# EasyEDA Pro project connect.eprj

# Schematic Schematic1
Create Date: 2023-11-16; Page Name: P1; Project Name: connect; Schematic Name: Schematic1; Update Date: 2023-11-19; Company: 嘉立创EDA; Page Size: A4; Version: V1.0
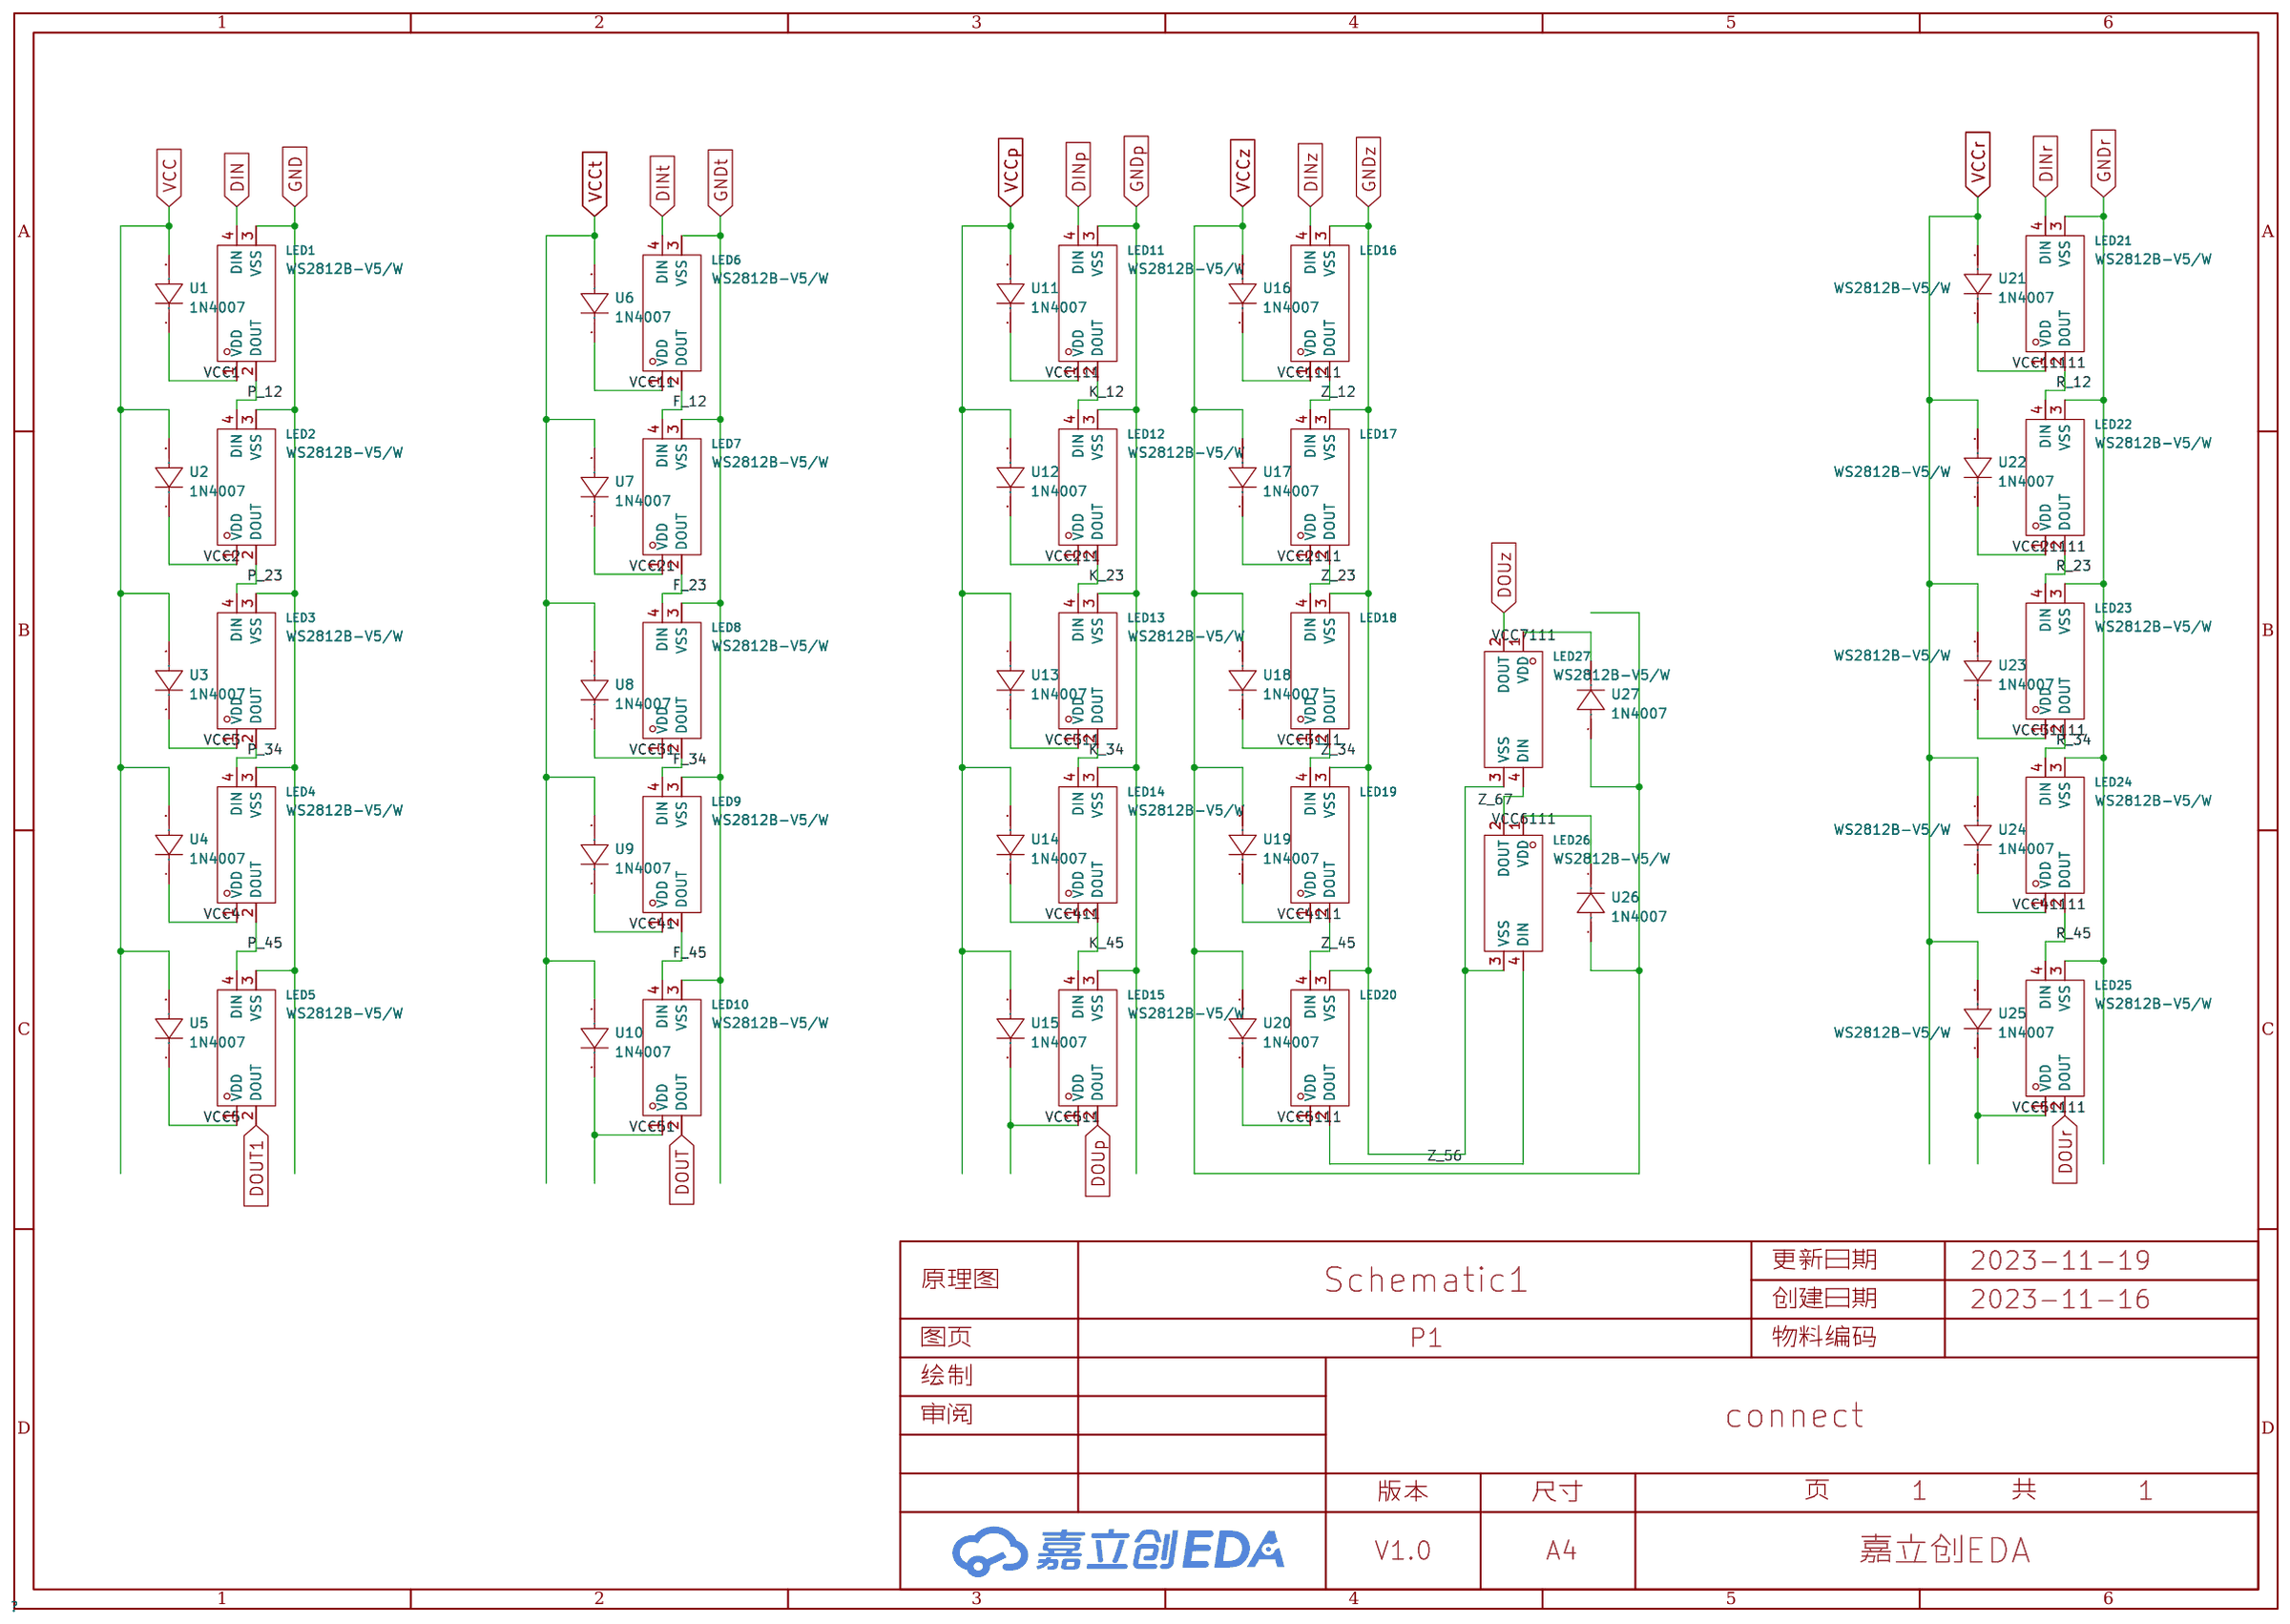
[diagram p0: schematic sheet]

## Parts
LED1  WS2812B-V5/W  [LED-SMD_4P-L5.0-W5.0-TL-1]
LED2  WS2812B-V5/W  [LED-SMD_4P-L5.0-W5.0-TL-1]
LED3  WS2812B-V5/W  [LED-SMD_4P-L5.0-W5.0-TL-1]
LED4  WS2812B-V5/W  [LED-SMD_4P-L5.0-W5.0-TL-1]
LED5  WS2812B-V5/W  [LED-SMD_4P-L5.0-W5.0-TL-1]
LED6  WS2812B-V5/W  [LED-SMD_4P-L5.0-W5.0-TL-1]
LED7  WS2812B-V5/W  [LED-SMD_4P-L5.0-W5.0-TL-1]
LED8  WS2812B-V5/W  [LED-SMD_4P-L5.0-W5.0-TL-1]
LED9  WS2812B-V5/W  [LED-SMD_4P-L5.0-W5.0-TL-1]
LED10  WS2812B-V5/W  [LED-SMD_4P-L5.0-W5.0-TL-1]
LED11  WS2812B-V5/W  [LED-SMD_4P-L5.0-W5.0-TL-1]
LED12  WS2812B-V5/W  [LED-SMD_4P-L5.0-W5.0-TL-1]
LED13  WS2812B-V5/W  [LED-SMD_4P-L5.0-W5.0-TL-1]
LED14  WS2812B-V5/W  [LED-SMD_4P-L5.0-W5.0-TL-1]
LED15  WS2812B-V5/W  [LED-SMD_4P-L5.0-W5.0-TL-1]
LED16  WS2812B-V5/W  [LED-SMD_4P-L5.0-W5.0-TL-1]
LED17  WS2812B-V5/W  [LED-SMD_4P-L5.0-W5.0-TL-1]
LED18  WS2812B-V5/W  [LED-SMD_4P-L5.0-W5.0-TL-1]
LED19  WS2812B-V5/W  [LED-SMD_4P-L5.0-W5.0-TL-1]
LED20  WS2812B-V5/W  [LED-SMD_4P-L5.0-W5.0-TL-1]
LED21  WS2812B-V5/W  [LED-SMD_4P-L5.0-W5.0-TL-1]
LED22  WS2812B-V5/W  [LED-SMD_4P-L5.0-W5.0-TL-1]
LED23  WS2812B-V5/W  [LED-SMD_4P-L5.0-W5.0-TL-1]
LED24  WS2812B-V5/W  [LED-SMD_4P-L5.0-W5.0-TL-1]
LED25  WS2812B-V5/W  [LED-SMD_4P-L5.0-W5.0-TL-1]
LED26  WS2812B-V5/W  [LED-SMD_4P-L5.0-W5.0-TL-1]
LED27  WS2812B-V5/W  [LED-SMD_4P-L5.0-W5.0-TL-1]
U1  1N4007  [SMA_L4.3-W2.6-LS5.1-RD]
U2  1N4007  [SMA_L4.3-W2.6-LS5.1-RD]
U3  1N4007  [SMA_L4.3-W2.6-LS5.1-RD]
U4  1N4007  [SMA_L4.3-W2.6-LS5.1-RD]
U5  1N4007  [SMA_L4.3-W2.6-LS5.1-RD]
U6  1N4007  [SMA_L4.3-W2.6-LS5.1-RD]
U7  1N4007  [SMA_L4.3-W2.6-LS5.1-RD]
U8  1N4007  [SMA_L4.3-W2.6-LS5.1-RD]
U9  1N4007  [SMA_L4.3-W2.6-LS5.1-RD]
U10  1N4007  [SMA_L4.3-W2.6-LS5.1-RD]
U11  1N4007  [SMA_L4.3-W2.6-LS5.1-RD]
U12  1N4007  [SMA_L4.3-W2.6-LS5.1-RD]
U13  1N4007  [SMA_L4.3-W2.6-LS5.1-RD]
U14  1N4007  [SMA_L4.3-W2.6-LS5.1-RD]
U15  1N4007  [SMA_L4.3-W2.6-LS5.1-RD]
U16  1N4007  [SMA_L4.3-W2.6-LS5.1-RD]
U17  1N4007  [SMA_L4.3-W2.6-LS5.1-RD]
U18  1N4007  [SMA_L4.3-W2.6-LS5.1-RD]
U19  1N4007  [SMA_L4.3-W2.6-LS5.1-RD]
U20  1N4007  [SMA_L4.3-W2.6-LS5.1-RD]
U21  1N4007  [SMA_L4.3-W2.6-LS5.1-RD]
U22  1N4007  [SMA_L4.3-W2.6-LS5.1-RD]
U23  1N4007  [SMA_L4.3-W2.6-LS5.1-RD]
U24  1N4007  [SMA_L4.3-W2.6-LS5.1-RD]
U25  1N4007  [SMA_L4.3-W2.6-LS5.1-RD]
U26  1N4007  [SMA_L4.3-W2.6-LS5.1-RD]
U27  1N4007  [SMA_L4.3-W2.6-LS5.1-RD]

## Library data of the parts
LED1-LED27 = WS2812B-V5/W: 无需外围元器件，有反接保护和过压保护，游乐设备，消费类电子，电竞领域，电脑周边及设备; LCSC Part Name: RGB三色 （注意防潮，请查阅规格书中对应具体内容）; Supplier Part: C2874885; Manufacturer: worldsemi; Supplier Footprint: SMD5050; JLCPCB Part Class: 扩展库; Datasheet: https://atta.szlcsc.com/upload/public/pdf/source/20220607/7C249E7978D02183621563743847A955.pdf; Supplier: LCSC
U1-U27 = 1N4007: Supplier Part: C9900004759; JLCPCB Part Class: Extended Part; Supplier: LCSC

## Nets
GND: LED1.3(VSS) LED2.3(VSS) LED3.3(VSS) LED4.3(VSS) LED5.3(VSS)
GNDp: LED11.3(VSS) LED12.3(VSS) LED13.3(VSS) LED14.3(VSS) LED15.3(VSS)
GNDr: LED21.3(VSS) LED22.3(VSS) LED23.3(VSS) LED24.3(VSS) LED25.3(VSS)
GNDt: LED6.3(VSS) LED7.3(VSS) LED8.3(VSS) LED9.3(VSS) LED10.3(VSS)
GNDz: LED16.3(VSS) LED17.3(VSS) LED18.3(VSS) LED19.3(VSS) LED20.3(VSS) LED26.3(VSS) LED27.3(VSS)
VCC: U1.2(A) U2.2(A) U3.2(A) U4.2(A) U5.2(A)
VCC1: LED1.1(VDD) U1.1(K)
VCC2: LED2.1(VDD) U2.1(K)
VCC3: LED3.1(VDD) U3.1(K)
VCC4: LED4.1(VDD) U4.1(K)
VCC5: LED5.1(VDD) U5.1(K)
VCC11: LED6.1(VDD) U6.1(K)
VCC21: LED7.1(VDD) U7.1(K)
VCC31: LED8.1(VDD) U8.1(K)
VCC41: LED9.1(VDD) U9.1(K)
VCC51: LED10.1(VDD) U10.1(K)
VCC111: LED11.1(VDD) U11.1(K)
VCC211: LED12.1(VDD) U12.1(K)
VCC311: LED13.1(VDD) U13.1(K)
VCC411: LED14.1(VDD) U14.1(K)
VCC511: LED15.1(VDD) U15.1(K)
VCC1111: LED16.1(VDD) U16.1(K)
VCC2111: LED17.1(VDD) U17.1(K)
VCC3111: LED18.1(VDD) U18.1(K)
VCC4111: LED19.1(VDD) U19.1(K)
VCC5111: LED20.1(VDD) U20.1(K)
VCC6111: LED26.1(VDD) U26.1(K)
VCC7111: LED27.1(VDD) U27.1(K)
VCC11111: LED21.1(VDD) U21.1(K)
VCC21111: LED22.1(VDD) U22.1(K)
VCC31111: LED23.1(VDD) U23.1(K)
VCC41111: LED24.1(VDD) U24.1(K)
VCC51111: LED25.1(VDD) U25.1(K)
VCCp: U11.2(A) U12.2(A) U13.2(A) U14.2(A) U15.2(A)
VCCr: U21.2(A) U22.2(A) U23.2(A) U24.2(A) U25.2(A)
VCCt: U6.2(A) U7.2(A) U8.2(A) U9.2(A) U10.2(A)
VCCz: U16.2(A) U17.2(A) U18.2(A) U19.2(A) U20.2(A) U26.2(A) U27.2(A)
DIN: LED1.4(DIN)
DINp: LED11.4(DIN)
DINr: LED21.4(DIN)
DINt: LED6.4(DIN)
DINz: LED16.4(DIN)
DOUp: LED15.2(DOUT)
DOUr: LED25.2(DOUT)
DOUT: LED10.2(DOUT)
DOUT1: LED5.2(DOUT)
DOUz: LED27.2(DOUT)
F_12: LED6.2(DOUT) LED7.4(DIN)
F_23: LED7.2(DOUT) LED8.4(DIN)
F_34: LED8.2(DOUT) LED9.4(DIN)
F_45: LED9.2(DOUT) LED10.4(DIN)
K_12: LED11.2(DOUT) LED12.4(DIN)
K_23: LED12.2(DOUT) LED13.4(DIN)
K_34: LED13.2(DOUT) LED14.4(DIN)
K_45: LED14.2(DOUT) LED15.4(DIN)
P_12: LED1.2(DOUT) LED2.4(DIN)
P_23: LED2.2(DOUT) LED3.4(DIN)
P_34: LED3.2(DOUT) LED4.4(DIN)
P_45: LED4.2(DOUT) LED5.4(DIN)
R_12: LED21.2(DOUT) LED22.4(DIN)
R_23: LED22.2(DOUT) LED23.4(DIN)
R_34: LED23.2(DOUT) LED24.4(DIN)
R_45: LED24.2(DOUT) LED25.4(DIN)
Z_12: LED16.2(DOUT) LED17.4(DIN)
Z_23: LED17.2(DOUT) LED18.4(DIN)
Z_34: LED18.2(DOUT) LED19.4(DIN)
Z_45: LED19.2(DOUT) LED20.4(DIN)
Z_56: LED20.2(DOUT) LED26.4(DIN)
Z_67: LED26.2(DOUT) LED27.4(DIN)

# Board PCB1
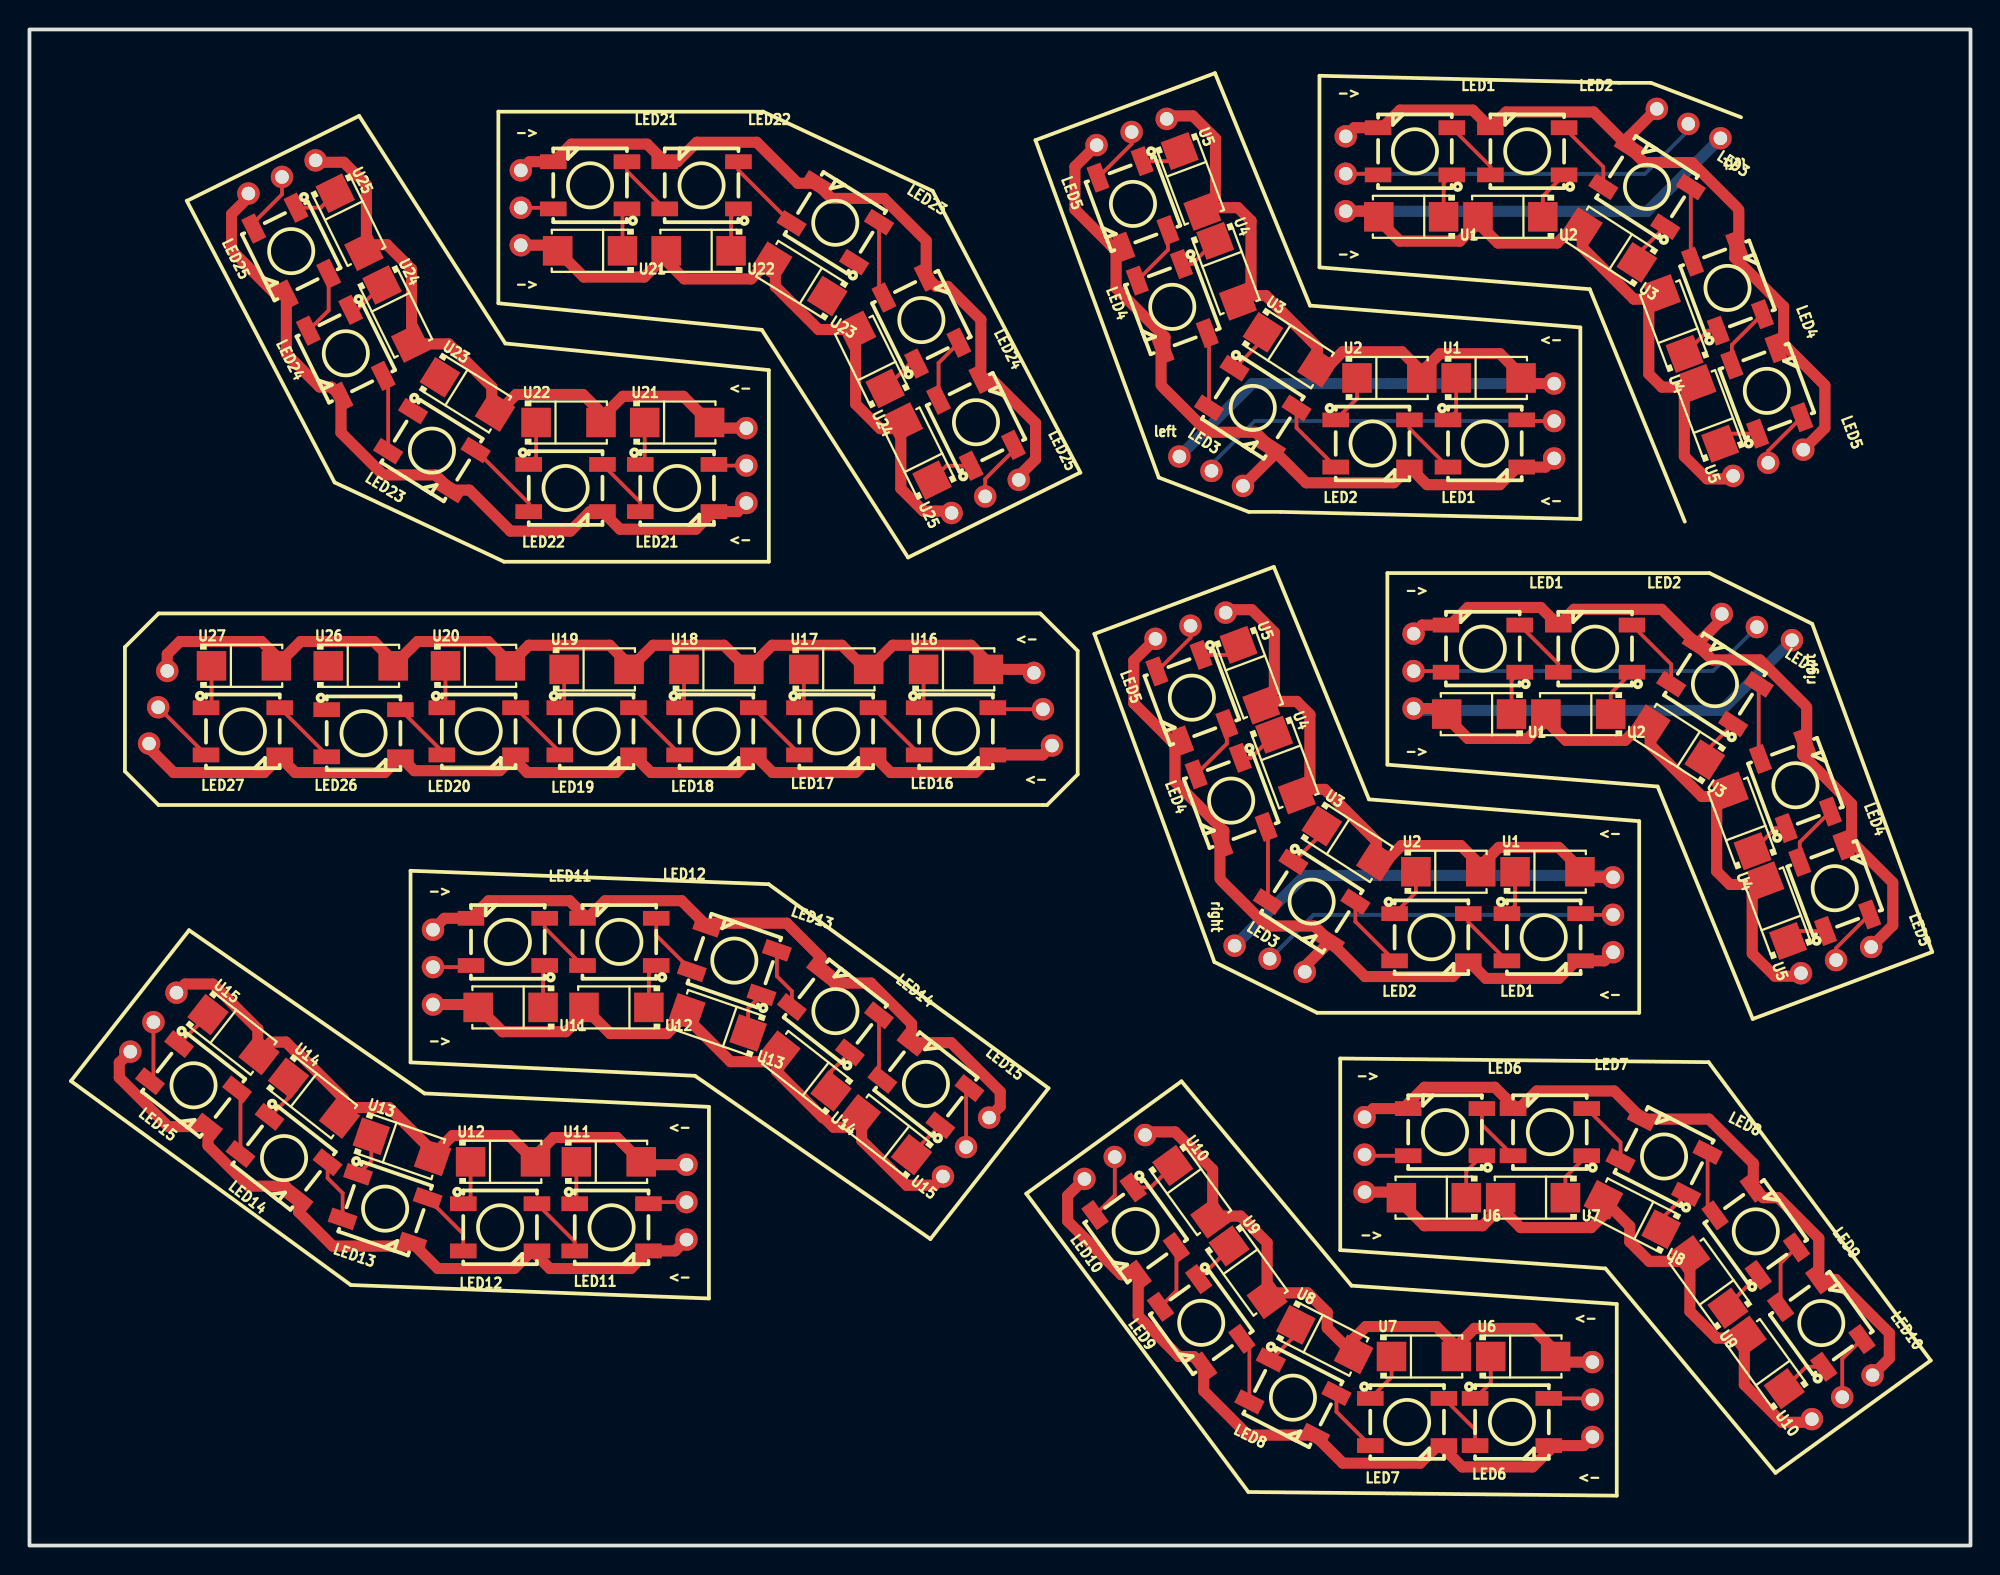
[diagram p1: board, top side]
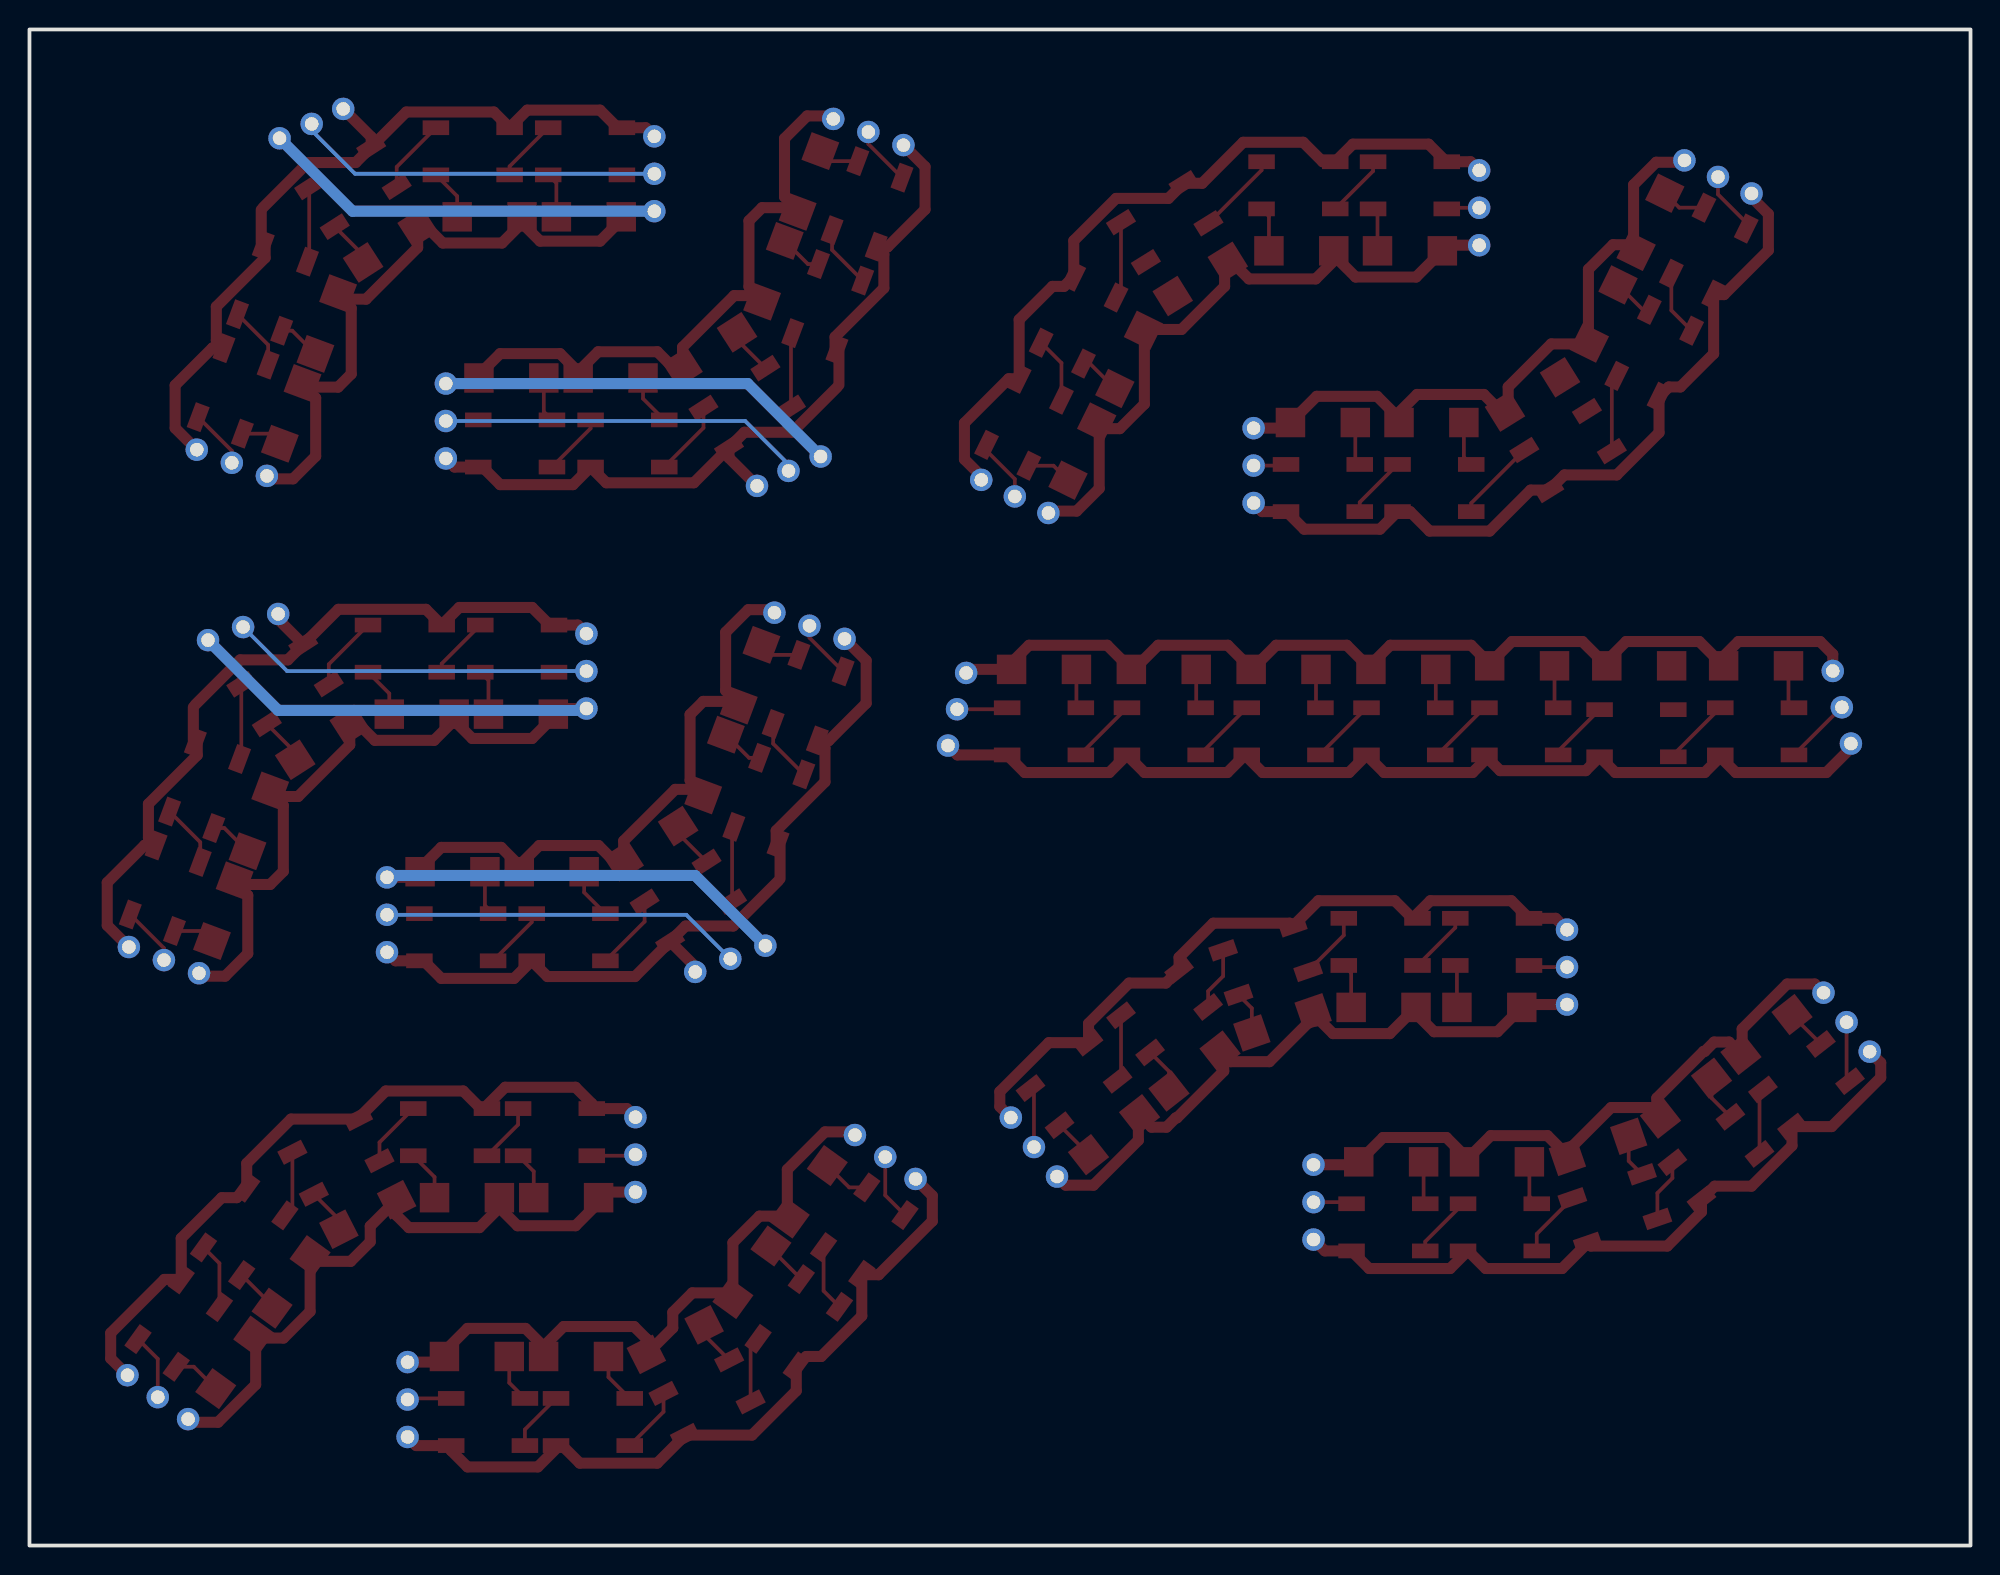
[diagram p2: board, bottom side, seen from below]

Outline 131.7 x 102.87 mm; copper layers: Top Layer, Bottom Layer. Coordinates in mm from the lower left corner of the outline.
Outline path: rectangle 0,102.87 131.7,0
Stack: Top Layer 0.035mm / Dielectric1 1.51mm FR4 er 4.5 / Bottom Layer 0.035mm

## Design rules (mm)
template: JLCPCB Capability(Two Layers Board)
spacing copperThickness1oz (default): track to track 0.102, other pairs 0.152 to 0.3
spacing copperThickness2oz: track to track 0.203, other pairs 0.152 to 0.3
track width copperThickness1oz (default): min 0.127, default 0.254, max 2.54
track width copperThickness2oz: min 0.203, default 0.254, max 2.54
differential pair differentialPair (default): width min 0.127, default 0.254, max 2.54; gap min 0.152, default 0.152
via viaSize (default): diameter min 0.5, default 0.61, max 10; hole min 0.3, default 0.305, max 6.3

## Placement (name value [footprint] x y rotation side)
LED1  WS2812B-V5/W  [LED-SMD_4P-L5.0-W5.0-TL-1]  98.61 60.86 180 top
LED1#2  -  [LED-SMD_4P-L5.0-W5.0-TL-1]  98.75 74.78 0 top
LED1#3  -  [LED-SMD_4P-L5.0-W5.0-TL-1]  94 94.6 180 top
LED1#4  -  [LED-SMD_4P-L5.0-W5.0-TL-1]  102.74 41.28 0 top
LED2  WS2812B-V5/W  [LED-SMD_4P-L5.0-W5.0-TL-1]  106.23 60.86 180 top
LED2#2  -  [LED-SMD_4P-L5.0-W5.0-TL-1]  91.13 74.78 0 top
LED2#3  -  [LED-SMD_4P-L5.0-W5.0-TL-1]  101.62 94.6 180 top
LED2#4  -  [LED-SMD_4P-L5.0-W5.0-TL-1]  95.12 41.28 0 top
LED3  WS2812B-V5/W  [LED-SMD_4P-L5.0-W5.0-TL-1]  114.36 58.44 147.2 top
LED3#2  -  [LED-SMD_4P-L5.0-W5.0-TL-1]  83 77.19 327.2 top
LED3#3  -  [LED-SMD_4P-L5.0-W5.0-TL-1]  109.75 92.19 147.2 top
LED3#4  -  [LED-SMD_4P-L5.0-W5.0-TL-1]  87 43.69 327.2 top
LED4  WS2812B-V5/W  [LED-SMD_4P-L5.0-W5.0-TL-1]  119.82 51.59 110.5 top
LED4#2  -  [LED-SMD_4P-L5.0-W5.0-TL-1]  77.54 84.05 290.5 top
LED4#3  -  [LED-SMD_4P-L5.0-W5.0-TL-1]  81.53 50.55 290.5 top
LED4#4  -  [LED-SMD_4P-L5.0-W5.0-TL-1]  115.21 85.33 110.5 top
LED5  WS2812B-V5/W  [LED-SMD_4P-L5.0-W5.0-TL-1]  78.87 57.53 290.5 top
LED5#2  -  [LED-SMD_4P-L5.0-W5.0-TL-1]  122.49 44.6 110.5 top
LED5#3  -  [LED-SMD_4P-L5.0-W5.0-TL-1]  74.87 91.03 290.5 top
LED5#4  -  [LED-SMD_4P-L5.0-W5.0-TL-1]  117.88 78.35 110.5 top
LED6  WS2812B-V5/W  [LED-SMD_4P-L5.0-W5.0-TL-1]  100.58 8.38 0 top
LED6#2  -  [LED-SMD_4P-L5.0-W5.0-TL-1]  96.05 28.05 180 top
LED7  WS2812B-V5/W  [LED-SMD_4P-L5.0-W5.0-TL-1]  93.47 8.38 0 top
LED7#2  -  [LED-SMD_4P-L5.0-W5.0-TL-1]  103.16 28.05 180 top
LED8  WS2812B-V5/W  [LED-SMD_4P-L5.0-W5.0-TL-1]  110.91 26.4 152.9 top
LED8#2  -  [LED-SMD_4P-L5.0-W5.0-TL-1]  85.72 10.03 332.9 top
LED9  WS2812B-V5/W  [LED-SMD_4P-L5.0-W5.0-TL-1]  117.13 21.32 125.9 top
LED9#2  -  [LED-SMD_4P-L5.0-W5.0-TL-1]  79.5 15.11 305.9 top
LED10  WS2812B-V5/W  [LED-SMD_4P-L5.0-W5.0-TL-1]  121.57 15.09 125.9 top
LED10#2  -  [LED-SMD_4P-L5.0-W5.0-TL-1]  75.06 21.34 305.9 top
LED11  WS2812B-V5/W  [LED-SMD_4P-L5.0-W5.0-TL-1]  32.46 40.96 180 top
LED11#2  -  [LED-SMD_4P-L5.0-W5.0-TL-1]  39.5 21.59 0 top
LED12  WS2812B-V5/W  [LED-SMD_4P-L5.0-W5.0-TL-1]  40.02 40.96 180 top
LED12#2  -  [LED-SMD_4P-L5.0-W5.0-TL-1]  31.93 21.59 0 top
LED13  WS2812B-V5/W  [LED-SMD_4P-L5.0-W5.0-TL-1]  47.83 39.69 161 top
LED13#2  -  [LED-SMD_4P-L5.0-W5.0-TL-1]  24.13 22.86 341 top
LED14  WS2812B-V5/W  [LED-SMD_4P-L5.0-W5.0-TL-1]  54.68 36.26 141.9 top
LED14#2  -  [LED-SMD_4P-L5.0-W5.0-TL-1]  17.27 26.29 321.9 top
LED15  WS2812B-V5/W  [LED-SMD_4P-L5.0-W5.0-TL-1]  60.82 31.32 141.9 top
LED15#2  -  [LED-SMD_4P-L5.0-W5.0-TL-1]  11.13 31.23 321.9 top
LED16  WS2812B-V5/W  [LED-SMD_4P-L5.0-W5.0-TL-1]  62.87 55.25 0 top
LED17  WS2812B-V5/W  [LED-SMD_4P-L5.0-W5.0-TL-1]  54.74 55.25 0 top
LED18  WS2812B-V5/W  [LED-SMD_4P-L5.0-W5.0-TL-1]  46.61 55.25 0 top
LED19  WS2812B-V5/W  [LED-SMD_4P-L5.0-W5.0-TL-1]  38.48 55.25 0 top
LED20  WS2812B-V5/W  [LED-SMD_4P-L5.0-W5.0-TL-1]  30.48 55.25 0 top
LED21  WS2812B-V5/W  [LED-SMD_4P-L5.0-W5.0-TL-1]  38.04 92.3 180 top
LED21#2  -  [LED-SMD_4P-L5.0-W5.0-TL-1]  43.94 71.76 0 top
LED22  WS2812B-V5/W  [LED-SMD_4P-L5.0-W5.0-TL-1]  45.6 92.3 180 top
LED22#2  -  [LED-SMD_4P-L5.0-W5.0-TL-1]  36.38 71.76 0 top
LED23  WS2812B-V5/W  [LED-SMD_4P-L5.0-W5.0-TL-1]  54.67 89.76 148.1 top
LED23#2  -  [LED-SMD_4P-L5.0-W5.0-TL-1]  27.31 74.3 328.1 top
LED24  WS2812B-V5/W  [LED-SMD_4P-L5.0-W5.0-TL-1]  60.52 83.15 116.3 top
LED24#2  -  [LED-SMD_4P-L5.0-W5.0-TL-1]  21.46 80.9 296.3 top
LED25  WS2812B-V5/W  [LED-SMD_4P-L5.0-W5.0-TL-1]  64.22 76.22 116.3 top
LED25#2  -  [LED-SMD_4P-L5.0-W5.0-TL-1]  17.76 87.83 296.3 top
LED26  WS2812B-V5/W  [LED-SMD_4P-L5.0-W5.0-TL-1]  22.67 55.12 0 top
LED27  WS2812B-V5/W  [LED-SMD_4P-L5.0-W5.0-TL-1]  14.48 55.25 0 top
NOREF  -  [Pad_e1443]  93.91 59.33 180 top
NOREF#2  -  [Pad_e1062]  125.05 11.56 305.9 top
NOREF#3  -  [Pad_e4678]  120.35 74.36 110.5 top
NOREF#4  -  [Pad_e1422]  120.2 38.83 110.5 top
NOREF#5  -  [Pad_e364]  72.4 95.03 290.5 top
NOREF#6  -  [Pad_e4637]  89.3 90.54 180 top
NOREF#7  -  [Pad_e328]  103.45 78.84 0 top
NOREF#8  -  [Pad_e39]  81.77 40.7 69.5 top
NOREF#9  -  [Pad_e37]  86.53 38.92 69.5 top
NOREF#10  -  [Pad_e1824]  62.57 70.06 116.3 top
NOREF#11  -  [Pad_e996]  90.59 26.52 180 top
NOREF#12  -  [Pad_e528]  75.69 27.85 125.9 top
NOREF#13  -  [Pad_e1007]  122.99 10.07 305.9 top
NOREF#14  -  [Pad_e365]  74.78 95.91 290.5 top
NOREF#15  -  [Pad_e1755]  33.34 88.23 180 top
NOREF#16  -  [Pad_e1442]  93.91 61.87 180 top
NOREF#17  -  [Pad_e526]  71.58 24.87 125.9 top
NOREF#18  -  [Pad_e1002]  120.94 8.58 305.9 top
NOREF#19  -  [Pad_e1208]  27.38 36.71 180 top
NOREF#20  -  [Pad_e1366]  114.82 63.21 249.5 top
NOREF#21  -  [Pad_e3]  107.44 45.34 0 top
NOREF#22  -  [Pad_e420]  17.13 92.86 296.3 top
NOREF#23  -  [Pad_e38]  84.15 39.81 69.5 top
NOREF#24  -  [Pad_e731]  9.35 59.34 102.2 top
NOREF#25  -  [Pad_e416]  48.64 75.82 0 top
NOREF#26  -  [Pad_e1779]  67.12 72.31 116.3 top
NOREF#27  -  [Pad_e400]  78.02 73.89 240.9 top
NOREF#28  -  [Pad_e750]  68.15 59.21 77.8 top
NOREF#29  -  [Pad_e1421]  122.58 39.72 110.5 top
NOREF#30  -  [Pad_e1756]  33.34 90.77 180 top
NOREF#31  -  [Pad_e505]  8.41 35.51 283.9 top
NOREF#32  -  [Pad_e498]  44.58 23.3 0 top
NOREF#33  -  [Pad_e506]  9.98 37.51 283.9 top
NOREF#34  -  [Pad_e4665]  110.41 97.48 61 top
NOREF#35  -  [Pad_e4725]  115.59 72.58 110.5 top
NOREF#36  -  [Pad_e4664]  112.55 96.46 61 top
NOREF#37  -  [Pad_e721]  8.73 56.88 102.2 top
NOREF#38  -  [Pad_e1206]  27.38 41.79 180 top
NOREF#39  -  [Pad_e4702]  117.97 73.47 110.5 top
NOREF#40  -  [Pad_e421]  14.86 91.74 296.3 top
NOREF#41  -  [Pad_e751]  68.76 56.75 77.8 top
NOREF#42  -  [Pad_e1159]  61.98 25.04 103.9 top
NOREF#43  -  [Pad_e402]  82.34 71.9 240.9 top
NOREF#44  -  [Pad_e525]  106.05 7.37 0 top
NOREF#45  -  [Pad_e394]  103.45 73.76 0 top
NOREF#46  -  [Pad_e1207]  27.38 39.25 180 top
NOREF#47  -  [Pad_e493]  44.58 20.76 0 top
NOREF#48  -  [Pad_e417]  48.64 73.28 0 top
NOREF#49  -  [Pad_e4670]  114.73 95.49 61 top
NOREF#50  -  [Pad_e995]  90.59 29.06 180 top
NOREF#51  -  [Pad_e726]  8.11 54.42 102.2 top
NOREF#52  -  [Pad_e11]  76.4 61.52 290.5 top
NOREF#53  -  [Pad_e1157]  63.55 27.04 103.9 top
NOREF#54  -  [Pad_e1419]  124.96 40.61 110.5 top
NOREF#55  -  [Pad_e401]  80.2 72.92 240.9 top
NOREF#56  -  [Pad_e4681]  89.3 95.62 180 top
NOREF#57  -  [Pad_e10]  78.78 62.41 290.5 top
NOREF#58  -  [Pad_e329]  103.45 76.3 0 top
NOREF#59  -  [Pad_e363]  77.16 96.8 290.5 top
NOREF#60  -  [Pad_e527]  73.64 26.36 125.9 top
NOREF#61  -  [Pad_e1757]  33.34 93.31 180 top
NOREF#62  -  [Pad_e9]  81.16 63.3 290.5 top
NOREF#63  -  [Pad_e752]  69.38 54.28 77.8 top
NOREF#64  -  [Pad_e499]  44.58 25.84 0 top
NOREF#65  -  [Pad_e1821]  64.84 71.19 116.3 top
NOREF#66  -  [Pad_e524]  106.05 9.91 0 top
NOREF#67  -  [Pad_e1425]  119.58 61.43 249.5 top
NOREF#68  -  [Pad_e1369]  117.21 62.32 249.5 top
NOREF#69  -  [Pad_e1444]  93.91 56.79 180 top
NOREF#70  -  [Pad_e5]  107.44 40.26 0 top
NOREF#71  -  [Pad_e997]  90.59 23.98 180 top
NOREF#72  -  [Pad_e419]  19.41 93.99 296.3 top
NOREF#73  -  [Pad_e504]  6.84 33.51 283.9 top
NOREF#74  -  [Pad_e418]  48.64 70.74 0 top
NOREF#75  -  [Pad_e523]  106.05 12.45 0 top
NOREF#76  -  [Pad_e4]  107.44 42.8 0 top
NOREF#77  -  [Pad_e4633]  89.3 93.08 180 top
NOREF#78  -  [Pad_e1169]  65.11 29.04 103.9 top
U1  1N4007  [SMA_L4.3-W2.6-LS5.1-RD]  98.36 56.41 180 top
U1#2  -  [SMA_L4.3-W2.6-LS5.1-RD]  99 79.22 0 top
U1#3  -  [SMA_L4.3-W2.6-LS5.1-RD]  93.75 90.16 180 top
U1#4  -  [SMA_L4.3-W2.6-LS5.1-RD]  103 45.72 0 top
U2  1N4007  [SMA_L4.3-W2.6-LS5.1-RD]  105.09 56.41 180 top
U2#2  -  [SMA_L4.3-W2.6-LS5.1-RD]  92.27 79.22 0 top
U2#3  -  [SMA_L4.3-W2.6-LS5.1-RD]  100.48 90.16 180 top
U2#4  -  [SMA_L4.3-W2.6-LS5.1-RD]  96.27 45.72 0 top
U3  1N4007  [SMA_L4.3-W2.6-LS5.1-RD]  111.82 54.51 147.2 top
U3#2  -  [SMA_L4.3-W2.6-LS5.1-RD]  85.54 81.13 327.2 top
U3#3  -  [SMA_L4.3-W2.6-LS5.1-RD]  107.21 88.25 147.2 top
U3#4  -  [SMA_L4.3-W2.6-LS5.1-RD]  89.53 47.62 327.2 top
U4  1N4007  [SMA_L4.3-W2.6-LS5.1-RD]  81.22 86.46 290.5 top
U4#2  -  [SMA_L4.3-W2.6-LS5.1-RD]  116.14 49.17 110.5 top
U4#3  -  [SMA_L4.3-W2.6-LS5.1-RD]  111.53 82.92 110.5 top
U4#4  -  [SMA_L4.3-W2.6-LS5.1-RD]  85.22 52.96 290.5 top
U5  1N4007  [SMA_L4.3-W2.6-LS5.1-RD]  118.55 43.08 110.5 top
U5#2  -  [SMA_L4.3-W2.6-LS5.1-RD]  78.81 92.56 290.5 top
U5#3  -  [SMA_L4.3-W2.6-LS5.1-RD]  113.94 76.82 110.5 top
U5#4  -  [SMA_L4.3-W2.6-LS5.1-RD]  82.8 59.06 290.5 top
U6  1N4007  [SMA_L4.3-W2.6-LS5.1-RD]  101.35 12.83 0 top
U6#2  -  [SMA_L4.3-W2.6-LS5.1-RD]  95.28 23.6 180 top
U7  1N4007  [SMA_L4.3-W2.6-LS5.1-RD]  94.62 12.83 0 top
U7#2  -  [SMA_L4.3-W2.6-LS5.1-RD]  102.02 23.6 180 top
U8  1N4007  [SMA_L4.3-W2.6-LS5.1-RD]  108.75 22.46 152.9 top
U8#2  -  [SMA_L4.3-W2.6-LS5.1-RD]  87.88 13.97 332.9 top
U9  1N4007  [SMA_L4.3-W2.6-LS5.1-RD]  113.95 17.89 125.9 top
U9#2  -  [SMA_L4.3-W2.6-LS5.1-RD]  82.68 18.54 305.9 top
U10  1N4007  [SMA_L4.3-W2.6-LS5.1-RD]  117.77 12.43 125.9 top
U10#2  -  [SMA_L4.3-W2.6-LS5.1-RD]  78.86 24 305.9 top
U11  1N4007  [SMA_L4.3-W2.6-LS5.1-RD]  32.65 36.51 180 top
U11#2  -  [SMA_L4.3-W2.6-LS5.1-RD]  39.31 26.03 0 top
U12  1N4007  [SMA_L4.3-W2.6-LS5.1-RD]  39.82 36.51 180 top
U12#2  -  [SMA_L4.3-W2.6-LS5.1-RD]  32.13 26.03 0 top
U13  1N4007  [SMA_L4.3-W2.6-LS5.1-RD]  46.68 35.5 161 top
U13#2  -  [SMA_L4.3-W2.6-LS5.1-RD]  25.27 27.05 341 top
U14  1N4007  [SMA_L4.3-W2.6-LS5.1-RD]  52.65 32.2 141.9 top
U14#2  -  [SMA_L4.3-W2.6-LS5.1-RD]  19.3 30.35 321.9 top
U15  1N4007  [SMA_L4.3-W2.6-LS5.1-RD]  58.11 27.88 141.9 top
U15#2  -  [SMA_L4.3-W2.6-LS5.1-RD]  13.84 34.67 321.9 top
U16  1N4007  [SMA_L4.3-W2.6-LS5.1-RD]  62.87 59.45 0 top
U17  1N4007  [SMA_L4.3-W2.6-LS5.1-RD]  54.74 59.45 0 top
U18  1N4007  [SMA_L4.3-W2.6-LS5.1-RD]  46.61 59.45 0 top
U19  1N4007  [SMA_L4.3-W2.6-LS5.1-RD]  38.48 59.45 0 top
U20  1N4007  [SMA_L4.3-W2.6-LS5.1-RD]  30.43 59.69 0 top
U21  1N4007  [SMA_L4.3-W2.6-LS5.1-RD]  38.04 87.85 180 top
U21#2  -  [SMA_L4.3-W2.6-LS5.1-RD]  43.94 76.2 0 top
U22  1N4007  [SMA_L4.3-W2.6-LS5.1-RD]  45.4 87.85 180 top
U22#2  -  [SMA_L4.3-W2.6-LS5.1-RD]  36.58 76.2 0 top
U23  1N4007  [SMA_L4.3-W2.6-LS5.1-RD]  52.26 85.95 148.1 top
U23#2  -  [SMA_L4.3-W2.6-LS5.1-RD]  29.72 78.11 328.1 top
U24  1N4007  [SMA_L4.3-W2.6-LS5.1-RD]  57.09 80.48 116.3 top
U24#2  -  [SMA_L4.3-W2.6-LS5.1-RD]  24.89 83.57 296.3 top
U25  1N4007  [SMA_L4.3-W2.6-LS5.1-RD]  60.26 74.26 116.3 top
U25#2  -  [SMA_L4.3-W2.6-LS5.1-RD]  21.72 89.79 296.3 top
U26  1N4007  [SMA_L4.3-W2.6-LS5.1-RD]  22.48 59.69 0 top
U27  1N4007  [SMA_L4.3-W2.6-LS5.1-RD]  14.55 59.69 0 top

## Footprints (pads in the part's own frame, mm; a bottom-side part is the same pattern mirrored in y, then rotated)
LED-SMD_4P-L5.0-W5.0-TL-1
  rect 1.8x1 smd: 1(-2.5,1.6) 2(-2.5,-1.6) 3(2.5,-1.6) 4(2.5,1.6)
Pad_e3
  round 1.524 hole 0.914: 7(0,0)
Pad_e4
  round 1.524 hole 0.914: 6(0,0)
Pad_e5
  round 1.524 hole 0.914: 5(0,0)
Pad_e9
  round 1.524 hole 0.914: 7(0,0)
Pad_e10
  round 1.524 hole 0.914: 6(0,0)
Pad_e11
  round 1.524 hole 0.914: 5(0,0)
Pad_e37
  round 1.524 hole 0.914: 5(0,0)
Pad_e38
  round 1.524 hole 0.914: 6(0,0)
Pad_e39
  round 1.524 hole 0.914: 7(0,0)
Pad_e328
  round 1.524 hole 0.914: 7(0,0)
Pad_e329
  round 1.524 hole 0.914: 6(0,0)
Pad_e363
  round 1.524 hole 0.914: 7(0,0)
Pad_e364
  round 1.524 hole 0.914: 5(0,0)
Pad_e365
  round 1.524 hole 0.914: 6(0,0)
Pad_e394
  round 1.524 hole 0.914: 5(0,0)
Pad_e400
  round 1.524 hole 0.914: 7(0,0)
Pad_e401
  round 1.524 hole 0.914: 6(0,0)
Pad_e402
  round 1.524 hole 0.914: 5(0,0)
Pad_e416
  round 1.524 hole 0.914: 7(0,0)
Pad_e417
  round 1.524 hole 0.914: 6(0,0)
Pad_e418
  round 1.524 hole 0.914: 5(0,0)
Pad_e419
  round 1.524 hole 0.914: 7(0,0)
Pad_e420
  round 1.524 hole 0.914: 6(0,0)
Pad_e421
  round 1.524 hole 0.914: 5(0,0)
Pad_e493
  round 1.524 hole 0.914: 5(0,0)
Pad_e498
  round 1.524 hole 0.914: 6(0,0)
Pad_e499
  round 1.524 hole 0.914: 7(0,0)
Pad_e504
  round 1.524 hole 0.914: 5(0,0)
Pad_e505
  round 1.524 hole 0.914: 6(0,0)
Pad_e506
  round 1.524 hole 0.914: 7(0,0)
Pad_e523
  round 1.524 hole 0.914: 7(0,0)
Pad_e524
  round 1.524 hole 0.914: 6(0,0)
Pad_e525
  round 1.524 hole 0.914: 5(0,0)
Pad_e526
  round 1.524 hole 0.914: 7(0,0)
Pad_e527
  round 1.524 hole 0.914: 6(0,0)
Pad_e528
  round 1.524 hole 0.914: 5(0,0)
Pad_e721
  round 1.524 hole 0.914: 1(0,0)
Pad_e726
  round 1.524 hole 0.914: 2(0,0)
Pad_e731
  round 1.524 hole 0.914: 3(0,0)
Pad_e750
  round 1.524 hole 0.914: 3(0,0)
Pad_e751
  round 1.524 hole 0.914: 1(0,0)
Pad_e752
  round 1.524 hole 0.914: 2(0,0)
Pad_e995
  round 1.524 hole 0.914: 5(0,0)
Pad_e996
  round 1.524 hole 0.914: 6(0,0)
Pad_e997
  round 1.524 hole 0.914: 7(0,0)
Pad_e1002
  round 1.524 hole 0.914: 5(0,0)
Pad_e1007
  round 1.524 hole 0.914: 6(0,0)
Pad_e1062
  round 1.524 hole 0.914: 7(0,0)
Pad_e1157
  round 1.524 hole 0.914: 6(0,0)
Pad_e1159
  round 1.524 hole 0.914: 7(0,0)
Pad_e1169
  round 1.524 hole 0.914: 5(0,0)
Pad_e1206
  round 1.524 hole 0.914: 5(0,0)
Pad_e1207
  round 1.524 hole 0.914: 6(0,0)
Pad_e1208
  round 1.524 hole 0.914: 7(0,0)
Pad_e1366
  round 1.524 hole 0.914: 5(0,0)
Pad_e1369
  round 1.524 hole 0.914: 6(0,0)
Pad_e1419
  round 1.524 hole 0.914: 5(0,0)
Pad_e1421
  round 1.524 hole 0.914: 6(0,0)
Pad_e1422
  round 1.524 hole 0.914: 7(0,0)
Pad_e1425
  round 1.524 hole 0.914: 7(0,0)
Pad_e1442
  round 1.524 hole 0.914: 5(0,0)
Pad_e1443
  round 1.524 hole 0.914: 6(0,0)
Pad_e1444
  round 1.524 hole 0.914: 7(0,0)
Pad_e1755
  round 1.524 hole 0.914: 7(0,0)
Pad_e1756
  round 1.524 hole 0.914: 6(0,0)
Pad_e1757
  round 1.524 hole 0.914: 5(0,0)
Pad_e1779
  round 1.524 hole 0.914: 5(0,0)
Pad_e1821
  round 1.524 hole 0.914: 6(0,0)
Pad_e1824
  round 1.524 hole 0.914: 7(0,0)
Pad_e4633
  round 1.524 hole 0.914: 6(0,0)
Pad_e4637
  round 1.524 hole 0.914: 7(0,0)
Pad_e4664
  round 1.524 hole 0.914: 6(0,0)
Pad_e4665
  round 1.524 hole 0.914: 5(0,0)
Pad_e4670
  round 1.524 hole 0.914: 7(0,0)
Pad_e4678
  round 1.524 hole 0.914: 5(0,0)
Pad_e4681
  round 1.524 hole 0.914: 5(0,0)
Pad_e4702
  round 1.524 hole 0.914: 6(0,0)
Pad_e4725
  round 1.524 hole 0.914: 7(0,0)
SMA_L4.3-W2.6-LS5.1-RD
  rect 2x2 smd: 1(-2.2,0) 2(2.2,0)

## Nets
GND: LED1.3 LED1#2.3 LED1#3.3 LED1#4.3 LED2.3 LED2#2.3 LED2#3.3 LED2#4.3 LED3.3 LED3#2.3 LED3#3.3 LED3#4.3 LED4.3 LED4#2.3 LED4#3.3 LED4#4.3 LED5.3 LED5#2.3 LED5#3.3 LED5#4.3 NOREF#3.5 NOREF#5.5 NOREF#9.5 NOREF#16.5 NOREF#20.5 NOREF#34.5 NOREF#43.5 NOREF#45.5 NOREF#52.5 NOREF#54.5 NOREF#56.5 NOREF#70.5
GNDP: LED11.3 LED11#2.3 LED12.3 LED12#2.3 LED13.3 LED13#2.3 LED14.3 LED14#2.3 LED15.3 LED15#2.3 NOREF#38.5 NOREF#47.5 NOREF#73.5 NOREF#78.5
GNDR: LED21.3 LED21#2.3 LED22.3 LED22#2.3 LED23.3 LED23#2.3 LED24.3 LED24#2.3 LED25.3 LED25#2.3 NOREF#26.5 NOREF#40.5 NOREF#61.5 NOREF#74.5
GNDT: LED6.3 LED6#2.3 LED7.3 LED7#2.3 LED8.3 LED8#2.3 LED9.3 LED9#2.3 LED10.3 LED10#2.3 NOREF#2.7 NOREF#17.7 NOREF#44.5 NOREF#50.5
GNDZ: LED16.3 LED17.3 LED18.3 LED19.3 LED20.3 LED26.3 LED27.3 NOREF#51.2 NOREF#63.2
VCC: NOREF#4.7 NOREF#6.7 NOREF#7.7 NOREF#8.7 NOREF#21.7 NOREF#27.7 NOREF#35.7 NOREF#49.7 NOREF#59.7 NOREF#62.7 NOREF#67.7 NOREF#69.7 U1.2 U1#2.2 U1#3.2 U1#4.2 U2.2 U2#2.2 U2#3.2 U2#4.2 U3.2 U3#2.2 U3#3.2 U3#4.2 U4.2 U4#2.2 U4#3.2 U4#4.2 U5.2 U5#2.2 U5#3.2 U5#4.2
VCC1: LED1.1 LED1#2.1 LED1#3.1 LED1#4.1 U1.1 U1#2.1 U1#3.1 U1#4.1
VCC2: LED2.1 LED2#2.1 LED2#3.1 LED2#4.1 U2.1 U2#2.1 U2#3.1 U2#4.1
VCC3: LED3.1 LED3#2.1 LED3#3.1 LED3#4.1 U3.1 U3#2.1 U3#3.1 U3#4.1
VCC4: LED4.1 LED4#2.1 LED4#3.1 LED4#4.1 U4.1 U4#2.1 U4#3.1 U4#4.1
VCC5: LED5.1 LED5#2.1 LED5#3.1 LED5#4.1 U5.1 U5#2.1 U5#3.1 U5#4.1
VCC11: LED6.1 LED6#2.1 U6.1 U6#2.1
VCC21: LED7.1 LED7#2.1 U7.1 U7#2.1
VCC31: LED8.1 LED8#2.1 U8.1 U8#2.1
VCC41: LED9.1 LED9#2.1 U9.1 U9#2.1
VCC51: LED10.1 LED10#2.1 U10.1 U10#2.1
VCC111: LED11.1 LED11#2.1 U11.1 U11#2.1
VCC211: LED12.1 LED12#2.1 U12.1 U12#2.1
VCC311: LED13.1 LED13#2.1 U13.1 U13#2.1
VCC411: LED14.1 LED14#2.1 U14.1 U14#2.1
VCC511: LED15.1 LED15#2.1 U15.1 U15#2.1
VCC1111: LED16.1 U16.1
VCC2111: LED17.1 U17.1
VCC3111: LED18.1 U18.1
VCC4111: LED19.1 U19.1
VCC5111: LED20.1 U20.1
VCC6111: LED26.1 U26.1
VCC7111: LED27.1 U27.1
VCC11111: LED21.1 LED21#2.1 U21.1 U21#2.1
VCC21111: LED22.1 LED22#2.1 U22.1 U22#2.1
VCC31111: LED23.1 LED23#2.1 U23.1 U23#2.1
VCC41111: LED24.1 LED24#2.1 U24.1 U24#2.1
VCC51111: LED25.1 LED25#2.1 U25.1 U25#2.1
VCCP: NOREF#19.7 NOREF#33.7 NOREF#42.7 NOREF#64.7 U11.2 U11#2.2 U12.2 U12#2.2 U13.2 U13#2.2 U14.2 U14#2.2 U15.2 U15#2.2
VCCR: NOREF#10.7 NOREF#15.7 NOREF#25.7 NOREF#72.7 U21.2 U21#2.2 U22.2 U22#2.2 U23.2 U23#2.2 U24.2 U24#2.2 U25.2 U25#2.2
VCCT: NOREF#12.5 NOREF#18.5 NOREF#71.7 NOREF#75.7 U6.2 U6#2.2 U7.2 U7#2.2 U8.2 U8#2.2 U9.2 U9#2.2 U10.2 U10#2.2
VCCZ: NOREF#24.3 NOREF#28.3 U16.2 U17.2 U18.2 U19.2 U20.2 U26.2 U27.2
DIN: LED1.4 LED1#2.4 LED1#3.4 LED1#4.4 NOREF.6 NOREF#23.6 NOREF#36.6 NOREF#55.6 NOREF#58.6 NOREF#68.6 NOREF#76.6 NOREF#77.6
DINP: LED11.4 LED11#2.4 NOREF#32.6 NOREF#46.6
DINR: LED21.4 LED21#2.4 NOREF#30.6 NOREF#48.6
DINT: LED6.4 LED6#2.4 NOREF#11.6 NOREF#66.6
DINZ: LED16.4 NOREF#41.1
DOUP: LED15.2 LED15#2.2 NOREF#31.6 NOREF#53.6
DOUR: LED25.2 LED25#2.2 NOREF#22.6 NOREF#65.6
DOUT: LED10.2 LED10#2.2 NOREF#13.6 NOREF#60.6
DOUT1: LED5.2 LED5#2.2 LED5#3.2 LED5#4.2 NOREF#14.6 NOREF#29.6 NOREF#39.6 NOREF#57.6
DOUZ: LED27.2 NOREF#37.1
F_12: LED6.2 LED6#2.2 LED7.4 LED7#2.4
F_23: LED7.2 LED7#2.2 LED8.4 LED8#2.4
F_34: LED8.2 LED8#2.2 LED9.4 LED9#2.4
F_45: LED9.2 LED9#2.2 LED10.4 LED10#2.4
K_12: LED11.2 LED11#2.2 LED12.4 LED12#2.4
K_23: LED12.2 LED12#2.2 LED13.4 LED13#2.4
K_34: LED13.2 LED13#2.2 LED14.4 LED14#2.4
K_45: LED14.2 LED14#2.2 LED15.4 LED15#2.4
P_12: LED1.2 LED1#2.2 LED1#3.2 LED1#4.2 LED2.4 LED2#2.4 LED2#3.4 LED2#4.4
P_23: LED2.2 LED2#2.2 LED2#3.2 LED2#4.2 LED3.4 LED3#2.4 LED3#3.4 LED3#4.4
P_34: LED3.2 LED3#2.2 LED3#3.2 LED3#4.2 LED4.4 LED4#2.4 LED4#3.4 LED4#4.4
P_45: LED4.2 LED4#2.2 LED4#3.2 LED4#4.2 LED5.4 LED5#2.4 LED5#3.4 LED5#4.4
R_12: LED21.2 LED21#2.2 LED22.4 LED22#2.4
R_23: LED22.2 LED22#2.2 LED23.4 LED23#2.4
R_34: LED23.2 LED23#2.2 LED24.4 LED24#2.4
R_45: LED24.2 LED24#2.2 LED25.4 LED25#2.4
Z_12: LED16.2 LED17.4
Z_23: LED17.2 LED18.4
Z_34: LED18.2 LED19.4
Z_45: LED19.2 LED20.4
Z_56: LED20.2 LED26.4
Z_67: LED26.2 LED27.4

## Routing (per net, layer and track width the routed paths; a pad name or vN(x,y) marks a point on that pad's centre or on a via; arc(x,y) is an arc through that point)
GND: length 217
  Top Layer w0.75: 80.9,45.09 83.95,42.04 87.18,42.04 LED3#4.3 ; LED3#3.3 108.51,95.58 NOREF#34.5 ; LED3#3.3 109.56,93.84 112.8,93.84 115.85,90.79 ; LED3#3.3 106.13,97.27 100.19,97.27 LED2#3.3 97.93,97.4 92.99,97.4 91.79,96.2 LED1#3.3 89.89,96.2 NOREF#56.5 ; NOREF#45.5 102.86,73.18 LED1#2.3 100.96,73.18 99.76,71.98 94.82,71.98 LED2#2.3 92.56,72.11 86.62,72.11 84.24,74.49 ; 76.9,78.59 79.95,75.54 83.19,75.54 84.24,74.49 ; 118.52,81.27 119.02,81.77 119.02,84.06 115.71,87.37 115.71,88.36 ; 118.52,81.27 119.28,81.27 121.82,78.73 121.82,75.82 NOREF#3.5 ; 118.52,81.27 118.5,81.25 ; NOREF#70.5 106.86,39.67 104.95,39.67 103.76,38.48 98.82,38.48 97.62,39.67 96.56,38.61 90.61,38.61 LED3#4.3 ; 84.24,74.49 84.24,73.8 NOREF#43.5 ; 74.23,88.11 74.25,88.13 ; 74.23,88.11 73.73,87.61 73.73,85.32 77.04,82.01 77.04,81.02 ; 74.23,88.11 73.47,88.11 70.94,90.65 70.94,93.56 NOREF#5.5 ; 123.13,47.52 123.88,47.52 126.42,44.98 126.42,42.08 NOREF#54.5 ; 123.13,47.52 123.63,48.02 123.63,50.32 120.32,53.63 120.32,54.62 ; 123.13,47.52 123.11,47.5 ; LED3#4.3 86.53,39.29 NOREF#9.5 ; 78.22,54.61 77.47,54.61 74.93,57.15 74.93,60.05 NOREF#52.5 ; 78.22,54.61 LED5.3 ; 78.22,54.61 77.72,54.11 77.72,51.82 81.04,48.5 81.04,47.52 ; NOREF#20.5 114.82,62.85 113.12,61.14 ; 113.12,61.14 110.74,63.52 104.8,63.52 LED2.3 102.54,63.65 97.59,63.65 96.4,62.46 LED1.3 94.5,62.46 NOREF#16.5 ; 113.12,61.14 114.17,60.1 117.41,60.1 120.45,57.05 ; 120.58,54.63 120.58,56.89 ; 115.97,88.38 115.97,90.63 ; 76.78,81 76.78,78.75 ; 80.77,47.5 80.77,45.24
GNDP: length 98.1
  Top Layer w0.75: NOREF#73.5 6.09,32.76 6.09,31.75 9.42,28.43 LED15#2.3 12.11,27.13 14.86,24.38 17.36,24.38 LED14#2.3 18.25,22.64 20.57,20.32 25.76,20.32 LED13#2.3 27.71,18.8 32.89,18.8 34.09,19.99 LED12#2.3 ; LED12.3 37.87,42.56 39.06,43.75 44.25,43.75 LED13.3 46.2,42.23 51.38,42.23 53.7,39.91 LED14.3 54.6,38.16 57.1,38.16 59.84,35.42 LED15.3 62.54,34.12 65.86,30.8 65.86,29.79 NOREF#78.5 ; 34.42,19.69 35.31,18.8 40.8,18.8 LED11#2.3 43.81,19.99 NOREF#47.5 ; 37.54,42.86 36.65,43.75 31.15,43.75 LED11.3 28.15,42.56 NOREF#38.5
GNDR: length 105.2
  Top Layer w0.75: NOREF#61.5 33.92,93.9 LED21.3 35.57,93.9 36.77,95.09 41.91,95.09 LED22.3 43.95,93.9 45.28,95.22 49.35,95.22 52.13,92.43 LED23.3 54.42,91.41 57.98,91.41 60.84,88.54 60.84,86.1 61.51,85.44 62.29,85.44 64.55,83.18 LED25.3 65.26,79.17 68.26,76.17 68.26,73.7 67,72.44 ; 14.98,91.61 13.72,90.35 13.72,87.88 16.72,84.88 LED25#2.3 17.43,80.87 19.69,78.61 20.47,78.61 LED24#2.3 21.13,75.51 24,72.64 27.56,72.64 LED23#2.3 29.85,71.62 32.63,68.83 36.7,68.83 38.02,70.16 38.88,70.16 40.07,68.96 45.21,68.96 46.41,70.16 48.06,70.16 NOREF#74.5
GNDT: length 101.4
  Top Layer w0.75: 100.87,29.65 101.08,29.65 102.27,30.84 107.52,30.84 LED8.3 109.43,28.94 113.95,28.94 116.96,25.93 LED9.3 117.64,23.6 118.65,23.6 121.4,20.85 LED10.3 122.55,18.06 126.19,14.41 126.19,12.69 NOREF#2.7 ; 100.87,29.65 LED7#2.3 ; 100.87,29.65 99.42,31.1 94.65,31.1 93.55,29.99 LED6#2.3 91.17,29.65 NOREF#50.5 ; 95.76,6.78 95.56,6.78 94.36,5.59 89.11,5.59 87.2,7.49 82.68,7.49 79.67,10.5 LED9#2.3 78.99,12.83 77.98,12.83 75.23,15.58 LED10#2.3 74.08,18.37 70.44,22.01 70.44,23.74 NOREF#17.7 ; 95.76,6.78 97.21,5.33 101.98,5.33 103.08,6.44 LED6.3 105.46,6.78 NOREF#44.5 ; 95.76,6.78 LED7.3
GNDZ: length 69.1
  Top Layer w0.75: 16.98,53.51 15.92,52.45 9.78,52.45 8.11,54.12 NOREF#51.2 ; 16.98,53.51 LED27.3 ; 16.98,53.51 18.03,52.45 24.1,52.45 LED26.3 26.11,52.58 31.91,52.58 LED20.3 32.98,53.25 33.78,52.45 39.79,52.45 LED19.3 40.98,53.63 42.16,52.45 48.03,52.45 49.22,53.64 ; 49.22,53.64 LED18.3 ; 49.22,53.64 50.42,52.45 56.04,52.45 LED17.3 58.43,52.45 64.17,52.45 LED16.3 68.74,53.64 NOREF#63.2
VCC: length 290
  Top Layer w0.75: NOREF#35.7 115.39,72.38 113.81,72.38 112.28,73.91 112.28,77.87 113.02,78.6 ; 113.02,78.6 110.76,78.6 109.87,79.49 109.87,83.96 110.48,84.57 ; 113.02,78.6 113.05,78.63 ; 96.2,56.16 97.59,54.76 101.66,54.76 102.89,55.99 ; 102.89,55.99 U2.2 ; 102.89,55.99 104.24,54.63 108.26,54.63 109.33,55.7 109.97,55.7 109.97,54.33 113.47,50.82 115.08,50.82 ; 86.27,51.31 87.88,51.31 91.38,47.81 U3#4.2 92.03,46.43 93.09,47.5 97.11,47.5 98.47,46.14 ; 86.27,51.31 86.88,51.92 86.88,56.39 85.99,57.28 83.73,57.28 ; 86.27,51.31 85.99,51.03 ; NOREF#6.7 91.17,90.54 U1#3.2 ; 110.48,84.57 108.86,84.57 105.36,88.07 U3#3.2 104.72,89.44 103.66,88.38 99.64,88.38 98.28,89.74 ; 110.48,84.57 110.76,84.85 ; 101.16,79.48 99.76,80.87 95.7,80.87 94.47,79.65 ; 115.08,50.82 115.37,51.11 ; 115.08,50.82 114.48,50.22 114.48,45.75 115.37,44.86 117.62,44.86 ; NOREF#7.7 101.58,78.84 U1#2.2 ; 82.27,84.81 83.89,84.81 87.39,81.31 87.39,79.94 88.03,79.94 89.1,81 93.12,81 94.47,79.65 ; 82.27,84.81 81.99,84.53 ; 82.27,84.81 82.88,85.42 82.88,89.89 81.99,90.78 79.73,90.78 ; 83.73,57.28 84.47,58.01 84.47,61.97 82.93,63.5 81.36,63.5 NOREF#62.7 ; 83.73,57.28 83.7,57.25 ; 79.73,90.78 79.71,90.75 ; 79.73,90.78 80.47,91.52 80.47,95.47 78.94,97 77.36,97 NOREF#59.7 ; 117.62,44.86 116.89,44.12 116.89,40.17 118.42,38.63 120,38.63 NOREF#4.7 ; 117.62,44.86 117.65,44.88 ; U1#4.2 105.58,45.34 NOREF#21.7 ; 105.16,45.97 103.76,47.37 99.69,47.37 98.47,46.14 ; U1.2 95.78,56.79 NOREF#69.7 ; 94.47,79.65 U2#2.2 ; 98.28,89.74 97.05,88.51 92.99,88.51 91.59,89.9 ; 98.28,89.74 U2#3.2 ; 98.47,46.14 98.47,45.72
  Bottom Layer w0.75: 114.71,95.47 109.78,90.54 NOREF#6.7 ; NOREF#67.7 114.82,56.67 94.04,56.67 NOREF#69.7 ; NOREF#8.7 86.53,45.47 107.31,45.47 NOREF#21.7 ; 78.04,73.91 82.97,78.84 NOREF#7.7
VCC1: length 12.3
  Top Layer w0.254: 96.8,79.22 96.8,76.93 LED1#2.1 ; LED1.1 100.56,58.7 100.56,56.41 ; LED1#4.1 100.8,43.43 U1#4.1 ; LED1#3.1 95.95,92.45 U1#3.1
VCC2: length 13.8
  Top Layer w0.254: LED2#3.1 102.68,91.56 U2#3.1 ; LED2#2.1 90.07,77.82 U2#2.1 ; LED2.1 107.29,57.81 U2.1 ; LED2#4.1 94.07,44.32 U2#4.1
VCC3: length 12.9
  Top Layer w0.254: U3#3.1 109.06,87.57 LED3#3.1 ; U3#4.1 87.69,48.31 LED3#4.1 ; LED3.1 113.67,53.82 U3.1 ; U3#2.1 83.69,81.82 LED3#2.1
VCC4: length 11.8
  Top Layer w0.254: U4#2.1 118.48,48.68 LED4.1 ; U4#3.1 113.87,82.43 LED4#4.1 ; LED4#2.1 78.88,86.95 U4.1 ; LED4#3.1 82.88,53.45 U4#4.1
VCC5: length 11.3
  Top Layer w0.254: LED5#3.1 77.36,93.94 U5#2.1 ; LED5.1 81.35,60.43 U5#4.1 ; U5.1 120,41.7 LED5#2.1 ; U5#3.1 115.39,75.45 LED5#4.1
VCC11: length 6.6
  Top Layer w0.254: U6.1 99.15,11.04 LED6.1 ; U6#2.1 97.48,25.39 LED6#2.1
VCC21: length 6.9
  Top Layer w0.254: LED7.1 92.41,11.43 U7.1 ; U7#2.1 104.22,25 LED7#2.1
VCC31: length 6.2
  Top Layer w0.254: U8#2.1 85.92,14.29 LED8#2.1 ; U8.1 110.71,22.14 112.4,23.84
VCC41: length 6.2
  Top Layer w0.254: LED9.1 115.24,16.29 U9.1 ; 79.33,18.08 81.39,20.14 U9#2.1
VCC51: length 6.6
  Top Layer w0.254: U10.1 120.55,12.13 LED10.1 ; U10#2.1 76.08,24.3 LED10#2.1
VCC111: length 5.8
  Top Layer w0.254: 37.11,26.03 37.11,23.3 LED11#2.1 ; U11.1 34.85,39.25 LED11.1
VCC211: length 6.1
  Top Layer w0.254: U12#2.1 29.93,23.69 LED12#2.1 ; 42.02,36.51 42.02,38.86 LED12.1
VCC311: length 5.9
  Top Layer w0.254: U13#2.1 23.19,26.09 LED13#2.1 ; 48.76,34.78 48.76,36.46 49.67,37.36
VCC411: length 6.3
  Top Layer w0.254: 54.38,30.84 54.38,32.18 LED14.1 ; U14#2.1 17.57,30.37 16.29,29.09
VCC511: length 5.6
  Top Layer w0.254: U15#2.1 12.11,35.99 LED15#2.1 ; LED15.1 59.84,26.56 U15.1
VCC1111: length 2.7
  Top Layer w0.254: LED16.1 60.66,57.14 U16.1
VCC2111: length 2.7
  Top Layer w0.254: LED17.1 52.54,57.14 U17.1
VCC3111: length 2.7
  Top Layer w0.254: LED18.1 44.41,57.14 U18.1
VCC4111: length 2.7
  Top Layer w0.254: LED19.1 36.28,57.14 U19.1
VCC5111: length 2.9
  Top Layer w0.254: U20.1 28.23,57.09 LED20.1
VCC7111: length 3
  Top Layer w0.254: LED27.1 12.35,57.22 U27.1
VCC11111: length 5.9
  Top Layer w0.254: LED21#2.1 41.74,73.66 U21#2.1 ; U21.1 40.24,90.39 LED21.1
VCC21111: length 6.1
  Top Layer w0.254: U22#2.1 34.38,73.86 LED22#2.1 ; LED22.1 47.6,90.2 U22.1
VCC41111: length 5.7
  Top Layer w0.254: LED24.1 59.75,80.2 58.06,78.51 ; U24#2.1 22.23,83.85 21.79,83.85
VCC51111: length 6.1
  Top Layer w0.254: LED25#2.1 19.76,90.78 U25#2.1 ; 63.89,73.27 62.22,73.27 U25.1
VCCP: length 91
  Top Layer w0.75: 44.4,35.59 44.81,35.59 47.57,32.83 50.2,32.83 50.67,33.3 ; NOREF#42.7 61.39,24.45 59.51,24.45 56.46,27.5 56.46,28.89 ; U15.2 56.38,29.19 55.57,28.39 54.56,28.39 53.92,29.02 53.84,29.02 50.67,32.19 50.67,33.3 ; 50.67,33.3 U14.2 ; U13.2 44.6,36.08 43.25,34.74 39.4,34.74 U12.2 37.62,36.09 36.39,34.86 32.1,34.86 U11.2 30.25,36.71 NOREF#19.7 ; 15.49,33.66 15.49,35.05 12.45,38.1 10.56,38.1 NOREF#33.7 ; 21.29,29.25 21.76,29.72 24.38,29.72 27.14,26.96 27.56,26.96 ; 21.29,29.25 21.29,30.36 18.12,33.53 18.03,33.53 17.4,34.16 16.38,34.16 15.58,33.36 U15#2.2 ; 21.29,29.25 21.04,29 ; U13#2.2 27.35,26.46 28.7,27.81 32.55,27.81 U12#2.2 34.33,26.46 35.56,27.69 39.86,27.69 41.51,26.03 41.7,25.84 NOREF#64.7
VCCR: length 91.5
  Top Layer w0.75: 59.12,76.06 58.84,75.78 57.72,75.78 56.05,77.45 56.05,82.52 ; 59.12,76.06 59.12,71.72 60.65,70.19 62.44,70.19 ; 59.12,76.06 59.29,76.23 ; 56.05,82.52 56.11,82.46 ; 56.05,82.52 53.53,82.52 50.61,85.44 50.61,86.83 ; 19.54,93.86 21.33,93.86 22.86,92.33 22.86,87.99 ; 22.86,87.99 U25#2.2 ; 22.86,87.99 23.14,88.27 24.26,88.27 25.92,86.6 25.92,81.53 ; NOREF#25.7 46.52,75.82 U21#2.2 44.36,77.98 40.26,77.98 38.97,76.69 ; 25.92,81.53 U24#2.2 ; 25.92,81.53 28.45,81.53 31.37,78.61 31.37,77.22 ; 50.39,87.11 50.12,87.11 48.96,85.95 44.42,85.95 43.01,87.36 ; 43.01,87.36 43.2,87.56 U22.2 ; 43.01,87.36 41.72,86.07 37.61,86.07 U21.2 35.46,88.23 NOREF#15.7 ; 38.97,76.69 38.78,76.5 38.78,76.2 ; 38.97,76.69 37.55,78.11 33.02,78.11 31.86,76.94 U23#2.2
VCCT: length 92.3
  Top Layer w0.75: 103.76,12.95 101.98,14.73 98.04,14.73 96.81,13.5 ; NOREF#75.7 103.93,12.45 U6.2 ; 96.81,13.5 U7.2 ; 96.81,13.5 95.46,14.86 90.67,14.86 89.84,14.03 U8#2.2 88.05,14.76 88.05,15.82 86.73,17.15 84.36,17.15 83.97,16.76 83.97,20.55 82.17,22.35 80.28,22.35 ; 116.35,14.08 116.35,10.92 118.91,8.36 120.72,8.36 NOREF#18.5 ; 116.35,14.08 U10.2 ; 116.35,14.08 114.46,14.08 112.66,15.88 U9.2 112.27,19.28 109.9,19.28 108.58,20.61 108.58,21.67 U8.2 106.79,22.4 105.96,21.57 101.17,21.57 99.82,22.93 ; NOREF#71.7 92.7,23.98 U6#2.2 ; NOREF#12.5 75.91,28.07 77.72,28.07 80.28,25.51 80.28,22.35 ; 80.28,22.35 80.15,22.22 ; 92.87,23.48 94.65,21.7 98.59,21.7 99.82,22.93 ; 99.82,22.93 U7#2.2
VCCZ: length 70.2
  Top Layer w0.75: 32.63,59.83 U20.2 ; 32.63,59.83 31.12,61.34 26.33,61.34 U26.2 24.68,60.03 23.37,61.34 18.4,61.34 U27.2 16.75,60.34 15.75,61.34 10.21,61.34 9.35,60.48 NOREF#24.3 ; 32.63,59.83 33.88,61.09 39.37,61.09 40.68,59.78 U19.2 42.32,61.09 47.12,61.09 48.75,59.45 ; 48.75,59.45 50.39,61.09 55.12,61.09 56.75,59.45 U17.2 58.57,61.09 63.88,61.09 65.06,59.9 U16.2 67.91,59.45 NOREF#28.3 ; 48.75,59.45 U18.2
DIN: length 107.8
  Top Layer w0.254: NOREF#77.6 91.43,93.08 LED1#3.4 ; NOREF.6 96.03,59.33 LED1.4 ; LED1#2.4 101.32,76.3 NOREF#58.6 ; NOREF#76.6 105.32,42.8 LED1#4.4
  Bottom Layer w0.254: NOREF#55.6 80.2,73.36 83.14,76.3 NOREF#58.6 ; NOREF#36.6 112.55,96.02 109.61,93.08 NOREF#77.6 ; NOREF#68.6 114.22,59.33 NOREF.6 ; NOREF#76.6 87.14,42.8 NOREF#23.6
DINP: length 5.3
  Top Layer w0.254: NOREF#46.6 29.85,39.25 LED11.4 ; LED11#2.4 42.11,23.3 NOREF#32.6
DINR: length 4.5
  Top Layer w0.254: LED21.4 35.46,90.77 NOREF#30.6 ; LED21#2.4 46.52,73.28 NOREF#48.6
DINT: length 6
  Top Layer w0.254: LED6.4 105.97,9.98 NOREF#66.6 ; LED6#2.4 90.66,26.45 NOREF#11.6
DINZ: length 3.4
  Top Layer w0.254: NOREF#41.1 65.46,56.75 LED16.4
DOUP: length 8.2
  Top Layer w0.254: NOREF#53.6 63.55,30.81 63.78,31.04 ; NOREF#31.6 8.41,31.74 LED15#2.2
DOUR: length 8.6
  Top Layer w0.254: NOREF#65.6 64.84,72.37 66.76,74.28 66.76,74.69 ; LED25#2.2 15.22,89.77 17.13,91.68 NOREF#22.6
DOUT: length 9
  Top Layer w0.254: NOREF#60.6 73.64,23.76 LED10#2.2 ; 124.34,14.01 122.99,12.67 NOREF#13.6
DOUT1: length 16.2
  Top Layer w0.254: 76.49,59.31 78.78,61.6 NOREF#57.6 ; NOREF#39.6 117.97,74.28 120.25,76.56 ; LED5#2.2 122.58,40.54 NOREF#29.6 ; NOREF#14.6 74.78,95.1 LED5#3.2
DOUZ: length 4.6
  Top Layer w0.254: LED27.2 8.74,56.88 NOREF#37.1
F_12: length 8.1
  Top Layer w0.254: LED7#2.4 98.55,28.56 LED6#2.2 ; LED7.4 98.08,7.87 LED6.2
F_23: length 9
  Top Layer w0.254: 107.95,26.11 107.95,27.35 LED7#2.2 ; LED8#2.4 88.68,9.07 LED7.2
F_34: length 9
  Top Layer w0.254: LED8.2 113.86,22.91 LED9.4 ; LED9#2.4 82.77,13.52 82.77,9.75
F_45: length 9
  Top Layer w0.254: 118.81,16.18 118.81,19.15 LED9.2 ; LED10#2.4 77.82,17.28 76.74,16.2
K_12: length 8.5
  Top Layer w0.254: LED12.4 34.96,41.92 LED11.2 ; LED11#2.2 37,20.62 LED12#2.4
K_23: length 9.1
  Top Layer w0.254: LED12#2.2 29.43,21.14 LED13#2.4 ; LED12.2 42.52,41.41 44.94,38.99
K_34: length 8.5
  Top Layer w0.254: LED14#2.4 20.23,24.93 21.25,23.91 LED13#2.2 ; 51.73,36.54 51.73,37.62 50.71,38.63 LED13.2
K_45: length 8.9
  Top Layer w0.254: LED14#2.2 14.32,30.71 LED15#2.4 ; 57.87,31.6 57.64,31.83 57.64,35.98
P_12: length 17.1
  Top Layer w0.254: 100.24,39.67 97.62,42.3 LED2#4.4 ; LED2#2.4 93.63,75.8 LED1#2.2 ; LED2#3.4 99.12,93.58 LED1#3.2 ; LED2.4 103.73,59.84 LED1.2
P_23: length 20.4
  Top Layer w0.254: LED2.2 111.39,59.8 111.39,58.45 ; 85.97,77.18 85.97,75.84 LED2#2.2 ; LED3#3.4 106.78,93.54 LED2#3.2 ; 92.62,39.67 89.96,42.34 LED3#4.4
P_34: length 20.5
  Top Layer w0.254: 117.45,53.37 117.33,53.49 LED3.2 ; LED3#3.2 112.72,87.23 LED4#4.4 ; LED4#3.4 84.03,48.64 LED3#4.2 ; 79.91,82.27 80.03,82.15 LED3#2.2
P_45: length 17.1
  Top Layer w0.254: 81.24,55.75 81.24,54.41 LED4#3.2 ; LED5#4.4 115.51,81.47 LED4#4.2 ; LED5#2.4 120.11,47.72 LED4.2 ; LED4#2.2 77.25,87.91 LED5#3.4
R_12: length 8.5
  Top Layer w0.254: 41.44,70.16 41.44,70.79 LED22#2.4 ; LED22.4 40.54,93.26 LED21.2
R_23: length 11.3
  Top Layer w0.254: LED23.4 48.1,93.32 LED22.2 ; LED23#2.4 33.88,70.73 33.88,70.16
R_34: length 10.5
  Top Layer w0.254: LED23.2 57.64,85.02 LED24.4 ; 24,79.37 24.34,79.03 LED23#2.2
R_45: length 8.9
  Top Layer w0.254: LED25#2.4 20.3,83.81 LED24#2.2 ; 63.06,81.62 61.68,80.24 61.68,77.75
Z_12: length 4.5
  Top Layer w0.254: LED17.4 60.37,53.72 LED16.2
Z_23: length 4.5
  Top Layer w0.254: LED18.4 52.24,53.72 LED17.2
Z_34: length 4.5
  Top Layer w0.254: LED19.4 44.11,53.72 LED18.2
Z_45: length 4.4
  Top Layer w0.254: LED20.4 35.98,53.84 LED19.2
Z_56: length 4.2
  Top Layer w0.254: LED20.2 27.98,53.91 LED26.4
Z_67: length 4.6
  Top Layer w0.254: LED27.4 20.17,53.66 LED26.2

## Copper pours and planes (outline as drawn; the poured copper is in the pictures)
GND on Top Layer: 0.33,102.87 131.7,102.87 131.7,0 0.33,0
GND on Bottom Layer: 0.38,103.25 132.08,103.25 132.08,-0.38 0.38,-0.38

## Text on the board
Top Silkscreen Layer: -> | right | left
